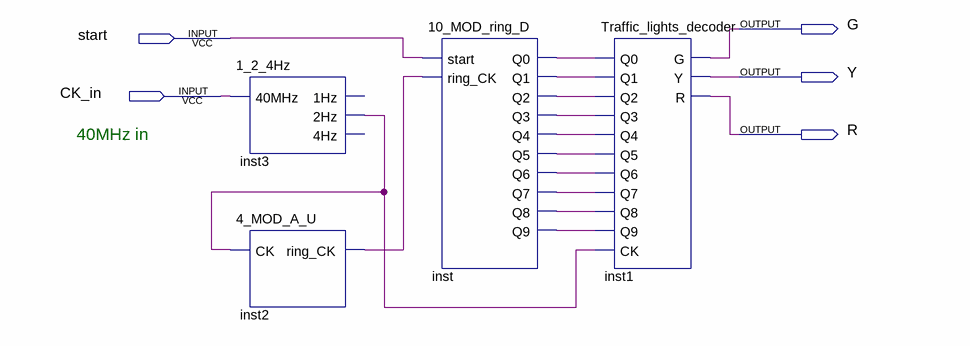
[diagram p0: schematic sheet]
// Quartus schematic Traffic_lights_S_test.bdf as structural Verilog: 4 symbols, 5 pins
module Traffic_lights_S_test (
  input  start,
  input  CK_in,
  output G,
  output Y,
  output R
);

  wire inst2_ring_ck, inst3_2hz, inst_q0, inst_q1, inst_q2, inst_q3, inst_q4, inst_q5, inst_q6, inst_q7,
       inst_q8, inst_q9;

  \1_2_4Hz  inst3 (.\40MHz (CK_in), .\2Hz (inst3_2hz));  // open: 1Hz, 4Hz
  \4_MOD_A_U  inst2 (.CK(inst3_2hz), .ring_CK(inst2_ring_ck));
  \10_MOD_ring_D  inst (
    .start(start), .ring_CK(inst2_ring_ck), .Q0(inst_q0), .Q1(inst_q1), .Q2(inst_q2), .Q3(inst_q3),
    .Q4(inst_q4), .Q5(inst_q5), .Q6(inst_q6), .Q7(inst_q7), .Q8(inst_q8), .Q9(inst_q9));
  Traffic_lights_decoder inst1 (
    .Q0(inst_q0), .Q1(inst_q1), .Q2(inst_q2), .Q3(inst_q3), .Q4(inst_q4), .Q5(inst_q5), .Q6(inst_q6),
    .Q7(inst_q7), .Q8(inst_q8), .Q9(inst_q9), .CK(inst3_2hz), .G(G), .Y(Y), .R(R));

  // Notes on the sheet:
  //   40MHz in
endmodule
